# EAGLE design esp-01 board (EAGLE 7.3.0)
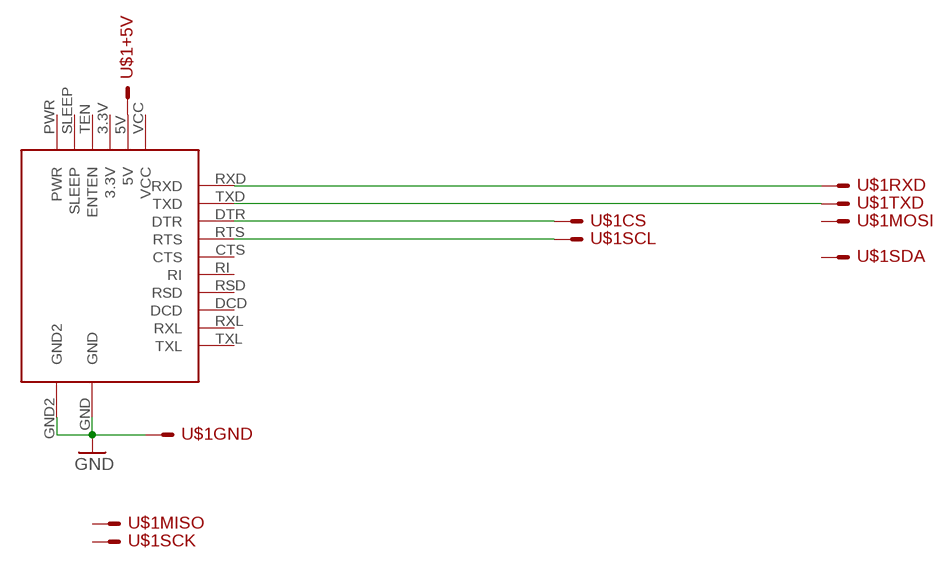
[diagram p0: schematic, sheet 1]

## Parts
U$1  SPI_BUS  [SPI_BUS]
U$3  FTDI232  [FT232-MODULE]

## Nets
GND: U$1.GND U$3.GND U$3.GND2
N$1: U$1.RXD U$3.RXD
N$2: U$1.+5V U$3.5V
N$3: U$1.TXD U$3.TXD
N$4: U$1.CS U$3.DTR
N$5: U$1.SCL U$3.RTS
Unconnected: U$1.MISO U$1.MOSI U$1.SCK U$1.SDA U$3.3.3V U$3.CTS U$3.DCD U$3.PWR U$3.RI U$3.RSD U$3.RXL U$3.SLEEP U$3.TEN(ENTEN) U$3.TXL U$3.VCC

## Library data of the parts
U$1 = lieven:SPI_BUS
U$3 = lieven:FTDI232

## Board
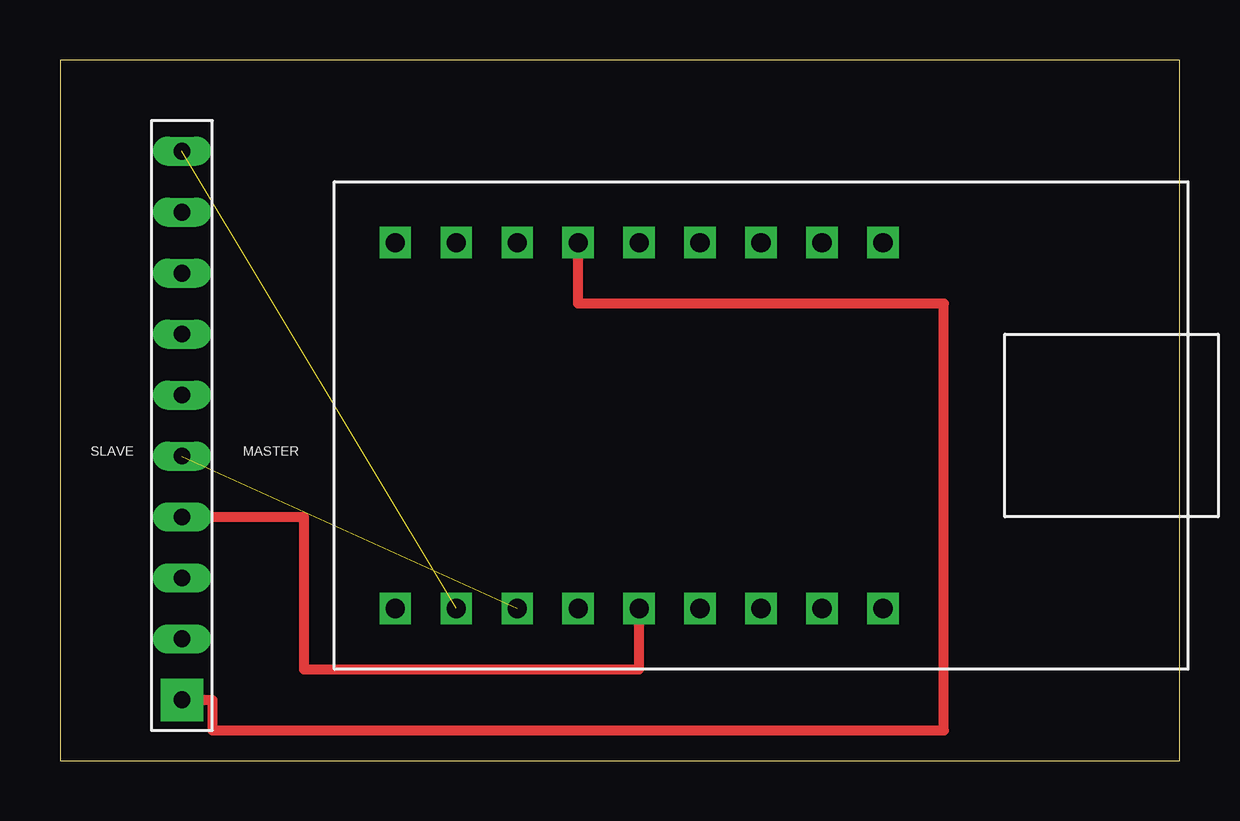
[diagram p1: board, top side]
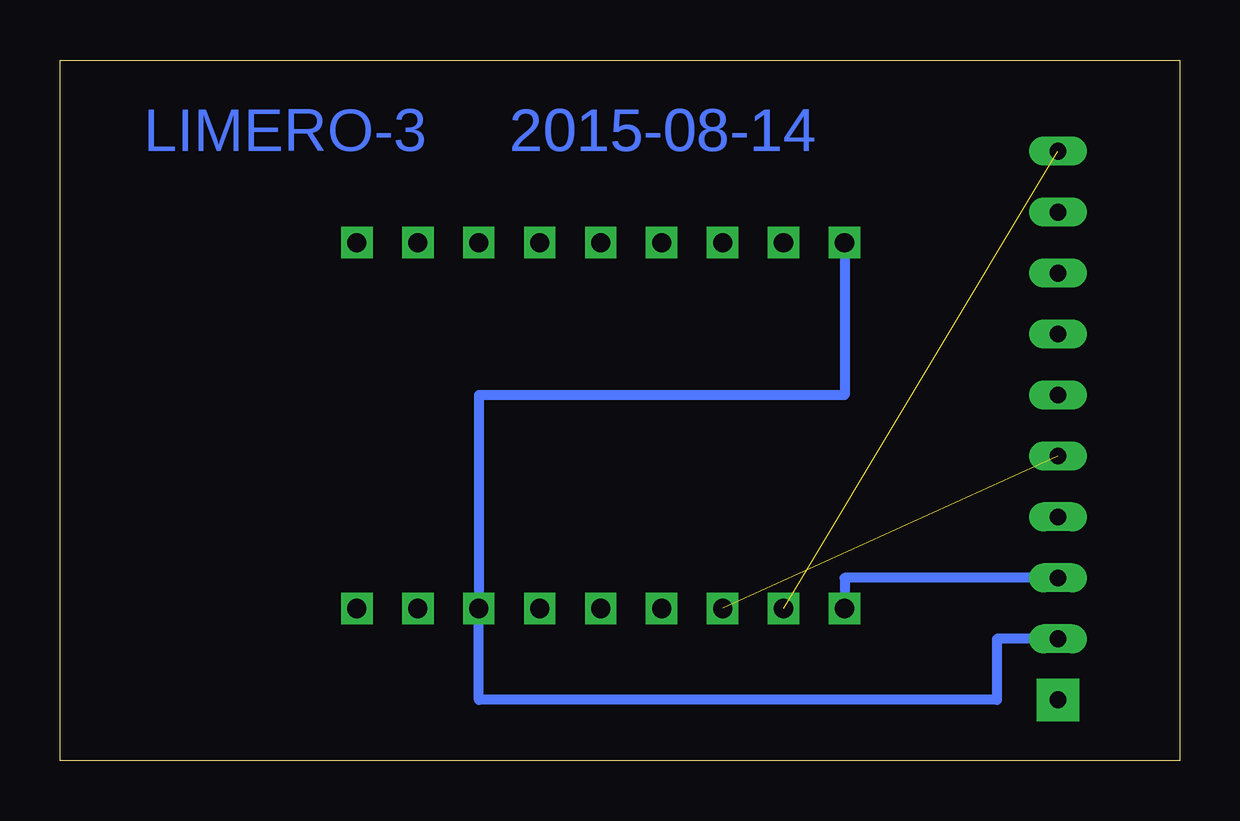
[diagram p2: board, bottom side, seen from below]

Size 46.66 x 29.2 mm. Coordinates in mm from the lower left corner, seen from the top.
Outline: 0,0 46.66,0 46.66,29.2 0,29.2 0,0
Copper layers (1*16): Top 0.035mm / dielectric 1.5mm / Bottom 0.035mm
Design rules "default": minimum track width 10mil, minimum drill 24mil, track to track 8mil, track to pad 8mil, pad to pad 8mil, via to via 8mil, smd to smd 8mil, copper to edge 40mil, drill to drill 8mil, minimum pad ring 10mil, minimum via ring 8mil, stop-mask expansion 4mil, vias tented up to drill 0mil, thermal gap 10mil

### Footprints (pad centres in the part's own frame; a part is rotated, then mirrored left to right if it is on the bottom)
SPI_BUS = drill 0.7 pad 1.778 square: +5V 0,0 | drill 0.7 long: CS 0,22.86; GND 0,2.54; MISO 0,15.24; MOSI 0,17.78; RXD 0,7.62; SCK 0,20.32; SCL 0,10.16; SDA 0,12.7; TXD 0,5.08
FT232-MODULE = drill 0.8 square: 3.3V 2.54,-5.08; 5V 5.08,-5.08; CTS 0,-5.08; DCD -7.62,10.16; DTR 10.16,10.16; GND 12.7,-5.08; GND2 -2.54,10.16; PWR -7.62,-5.08; RI 0,10.16; RSD -5.08,10.16; RTS 7.62,10.16; RXD 2.54,10.16; RXL 7.62,-5.08; SLEEP -2.54,-5.08; TEN -5.08,-5.08; TXD 12.7,10.16; TXL 10.16,-5.08; VCC 5.08,10.16

### Placement (x,y rotation side)
U$1  5.08,2.54 0 top
U$3  26.67,16.51 180 top

### Tracks (layer width: path | path; a pad name or v marks a point on that pad's centre or on a via)
GND
  Bottom 0.406: U$1.GND 7.62,5.08 7.62,2.54 29.21,2.54 U$3.GND2 29.21,15.24 13.97,15.24 U$3.GND
N$1
  Top 0.406: U$1.RXD 10.16,10.16 10.16,3.81 24.13,3.81 U$3.RXD
N$2
  Top 0.406: U$1.+5V 6.35,2.54 6.35,1.27 36.83,1.27 36.83,19.05 21.59,19.05 U$3.5V
N$3
  Bottom 0.406: U$1.TXD 13.97,7.62 U$3.TXD
N$4  (1 unrouted)
N$5  (1 unrouted)

### Text on the board
Bottom: 2015-08-14 | 2015-08-14 | LIMERO-3